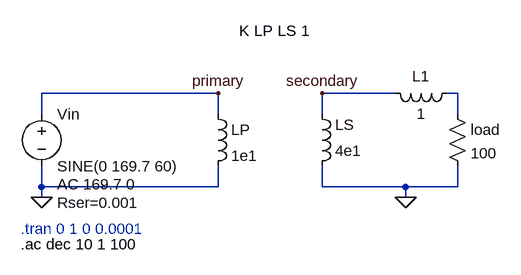
[diagram p0: schematic q1.asc]
q1.asc, the LTspice schematic file:
Version 4.1
SHEET 1 880 680
WIRE 256 96 -16 96
WIRE 528 96 416 96
WIRE 624 96 608 96
WIRE -16 128 -16 96
WIRE 256 128 256 96
WIRE 416 128 416 96
WIRE 624 128 624 96
WIRE -16 240 -16 208
WIRE 256 240 256 208
WIRE 256 240 -16 240
WIRE 416 240 416 208
WIRE 544 240 416 240
WIRE 624 240 624 208
WIRE 624 240 544 240
WIRE -16 256 -16 240
WIRE 544 256 544 240
FLAG -16 256 0
FLAG 544 256 0
FLAG 256 96 primary
FLAG 416 96 secondary
SYMBOL voltage -16 112 R0
WINDOW 123 24 124 Left 2
WINDOW 39 24 152 Left 2
SYMATTR Value2 AC 169.7 0
SYMATTR SpiceLine Rser=0.001
SYMATTR InstName Vin
SYMATTR Value SINE(0 169.7 60)
SYMBOL ind 240 112 R0
SYMATTR InstName LP
SYMATTR Value 1e1
SYMATTR Type ind
SYMATTR SpiceLine Rser=0
SYMBOL ind 400 224 M180
WINDOW 0 36 80 Left 2
WINDOW 3 36 40 Left 2
SYMATTR InstName LS
SYMATTR Value 4e1
SYMATTR Type ind
SYMATTR SpiceLine Rser=0
SYMBOL res 608 112 R0
SYMATTR InstName load
SYMATTR Value 100
SYMBOL ind 624 80 R90
WINDOW 0 5 56 VBottom 2
WINDOW 3 32 56 VTop 2
SYMATTR InstName L1
SYMATTR Value 1
SYMATTR SpiceLine Rser=0
TEXT 288 0 Left 2 !K LP LS 1
TEXT -48 304 Left 2 ;.tran 0 1 0 0.0001
TEXT -48 328 Left 2 !.ac dec 10 1 100

The netlist it stands for:
* q1.asc
Vin primary 0 SINE(0 169.7 60) AC 169.7 0 Rser=0.001
LP primary 0 1e1 Rser=0
LS 0 secondary 4e1 Rser=0
R§load N001 0 100
L1 N001 secondary 1 Rser=0
K LP LS 1
* .tran 0 1 0 0.0001
.ac dec 10 1 100
.backanno
.end